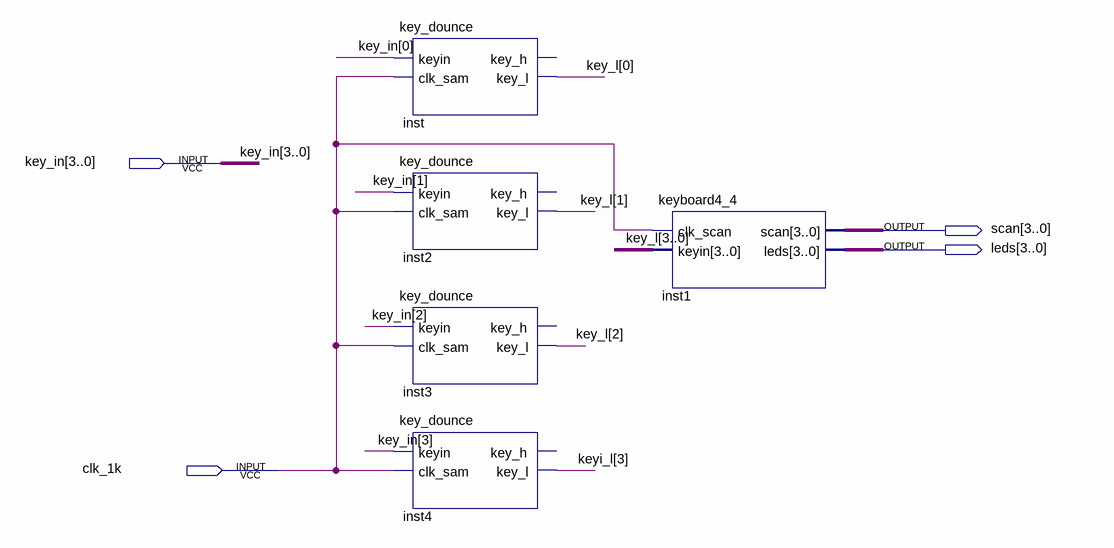
[diagram p0: schematic sheet]
// Quartus schematic key4_4.bdf as structural Verilog: 5 symbols, 4 pins
module key4_4 (
  input  [3:0] key_in,
  input  clk_1k,
  output [3:0] scan,
  output [3:0] leds
);

  wire [3:0] key_l;
  wire [3:3] keyi_l;

  key_dounce inst (.keyin(key_in[0]), .clk_sam(clk_1k), .key_l(key_l[0]));  // open: key_h
  key_dounce inst2 (.keyin(key_in[1]), .clk_sam(clk_1k), .key_l(key_l[1]));  // open: key_h
  key_dounce inst3 (.keyin(key_in[2]), .clk_sam(clk_1k), .key_l(key_l[2]));  // open: key_h
  key_dounce inst4 (.keyin(key_in[3]), .clk_sam(clk_1k), .key_l(keyi_l[3]));  // open: key_h
  keyboard4_4 inst1 (.clk_scan(clk_1k), .keyin(key_l), .scan(scan), .leds(leds));
endmodule
